# Altium schematic sheet interface.SchDoc
size A4
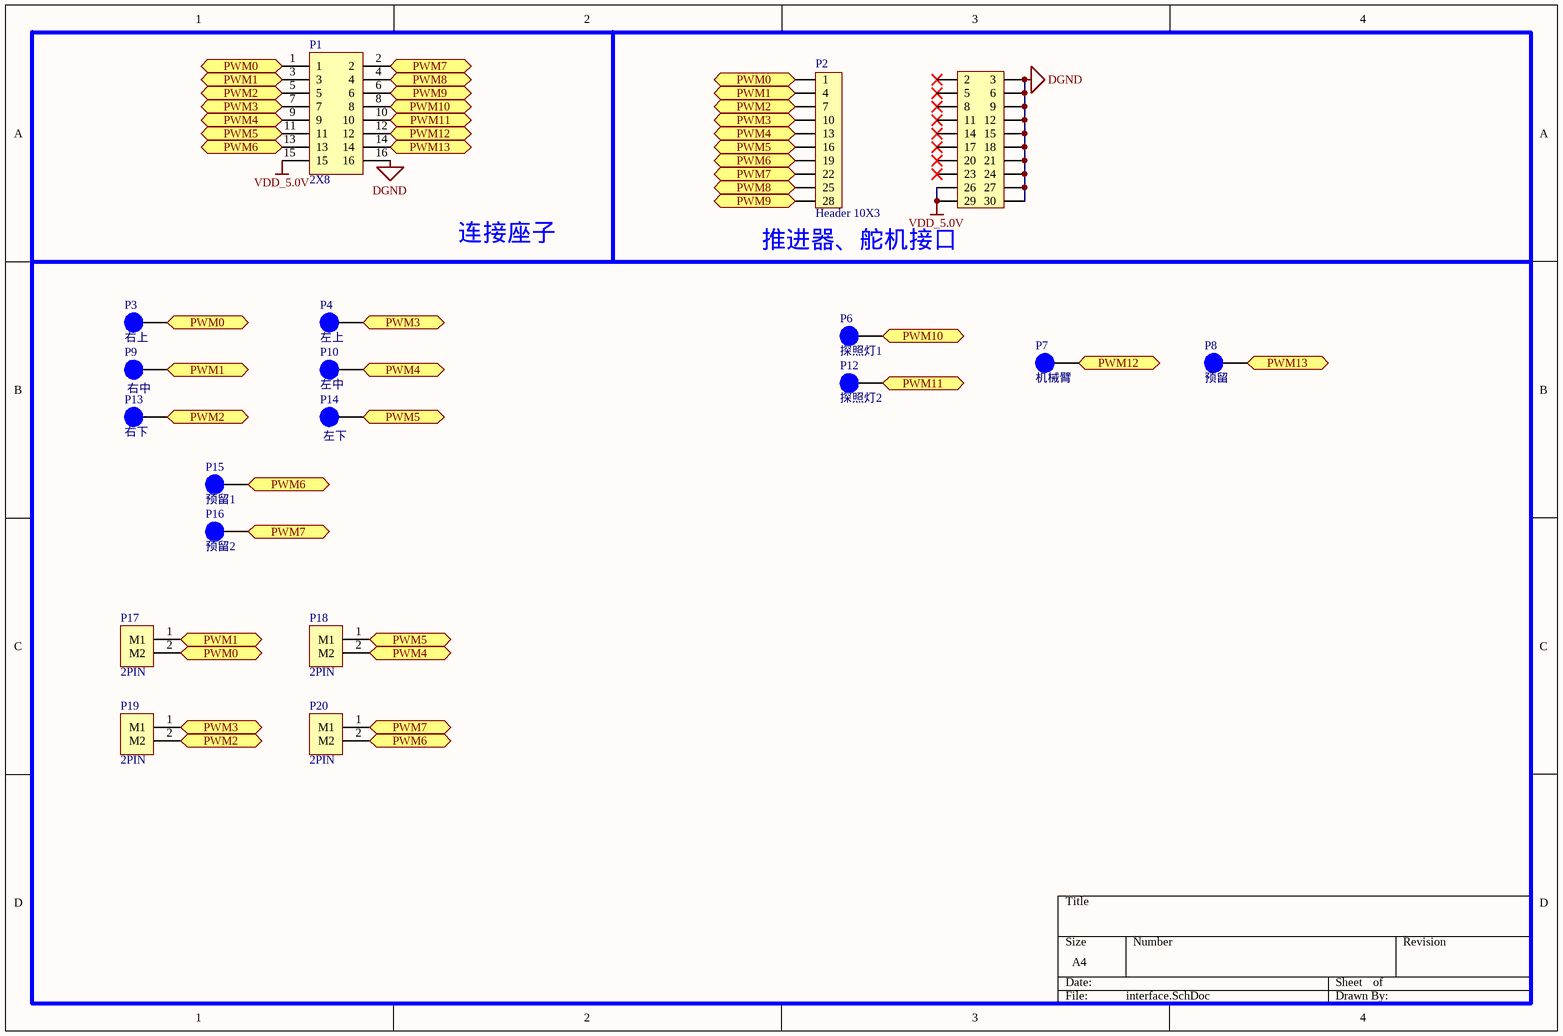
[diagram p0: interface.SchDoc]

## Parts
P1  2X8  [HEADER 2X8 反向]
P2  Header 10X3  [Header 10x3]
P3  右上  [PIN 1]
P4  左上  [PIN 1]
P6  探照灯1  [PIN 1]
P7  机械臂  [PIN 1]
P8  预留  [PIN 1]
P9  右中  [PIN 1]
P10  左中  [PIN 1]
P12  探照灯2  [PIN 1]
P13  右下  [PIN 1]
P14  左下  [PIN 1]
P15  预留1  [PIN 1]
P16  预留2  [PIN 1]
P17  2PIN  [MX1.25WS-2P]
P18  2PIN  [MX1.25WS-2P]
P19  2PIN  [MX1.25WS-2P]
P20  2PIN  [MX1.25WS-2P]

## Ports
PWM0, PWM1, PWM2, PWM3, PWM4, PWM5, PWM6, PWM7, PWM8, PWM9, PWM10, PWM11, PWM12, PWM13

## Nets
DGND: P1.16 P2.3 P2.6 P2.9 P2.12 P2.15 P2.18 P2.21 P2.24 P2.27 P2.30
VDD_5.0V: P1.15 P2.26 P2.29
PWM0: P1.1 P2.1 P3.1 P17.2(M2) ; port PWM0
PWM1: P1.3 P2.4 P9.1 P17.1(M1) ; port PWM1
PWM2: P1.5 P2.7 P13.1 P19.2(M2) ; port PWM2
PWM3: P1.7 P2.10 P4.1 P19.1(M1) ; port PWM3
PWM4: P1.9 P2.13 P10.1 P18.2(M2) ; port PWM4
PWM5: P1.11 P2.16 P14.1 P18.1(M1) ; port PWM5
PWM6: P1.13 P2.19 P15.1 P20.2(M2) ; port PWM6
PWM7: P1.2 P2.22 P16.1 P20.1(M1) ; port PWM7
PWM8: P1.4 P2.25 ; port PWM8
PWM9: P1.6 P2.28 ; port PWM9
PWM10: P1.8 P6.1 ; port PWM10
PWM11: P1.10 P12.1 ; port PWM11
PWM12: P1.12 P7.1 ; port PWM12
PWM13: P1.14 P8.1 ; port PWM13

Not connected (* = marked no-connect by the designer): P2 2* 5* 8* 11* 14* 17* 20* 23*

## Notes on the sheet
- 连接座子
- (near P2) 推进器、舵机接口

## Library data of the parts
P1 = Header 2X8
P3 P4 P6-P10 P12-P16 = 测试点
P17-P20 = 接线端子-2PIN